# Altium schematic sheet future_connector.SchDoc
size A4
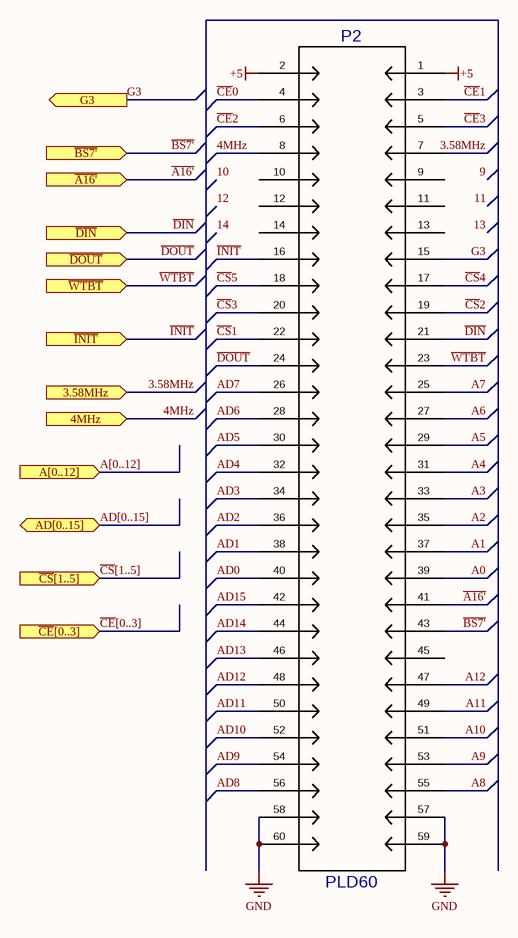
[diagram p0: future_connector.SchDoc]

## Parts
P2  PLD60  [PLD60]

## Ports
3.58MHz (in), 4MHz (in), A[0..12] (in), AD[0..15] (bidir), G3 (out), ~{A16'} (in), ~{BS7'} (in), ~{CE}[0..3] (in), ~{CS}[1..5] (in), ~{DIN} (in), ~{DOUT} (in), ~{INIT} (in), ~{WTBT} (in)

## Nets
+5: P2.1 P2.2
GND: P2.57 P2.58 P2.59 P2.60
3.58MHz: P2.7 ; port 3.58MHz
4MHz: P2.8 ; port 4MHz
A0: P2.39
A1: P2.37
A2: P2.35
A3: P2.33
A4: P2.31
A5: P2.29
A6: P2.27
A7: P2.25
A8: P2.55
A9: P2.53
A10: P2.51
A11: P2.49
A12: P2.47
~{A16'}: P2.41 ; port ~{A16'}
AD0: P2.40
AD1: P2.38
AD2: P2.36
AD3: P2.34
AD4: P2.32
AD5: P2.30
AD6: P2.28
AD7: P2.26
AD8: P2.56
AD9: P2.54
AD10: P2.52
AD11: P2.50
AD12: P2.48
AD13: P2.46
AD14: P2.44
AD15: P2.42
~{BS7'}: P2.43 ; port ~{BS7'}
~{CE}0: P2.4
~{CE}1: P2.3
~{CE}2: P2.6
~{CE}3: P2.5
~{CS}1: P2.22
~{CS}2: P2.19
~{CS}3: P2.20
~{CS}4: P2.17
~{CS}5: P2.18
~{DIN}: P2.21 ; port ~{DIN}
~{DOUT}: P2.24 ; port ~{DOUT}
G3: P2.15 ; port G3
~{INIT}: P2.16 ; port ~{INIT}
~{WTBT}: P2.23 ; port ~{WTBT}

Not connected (* = marked no-connect by the designer): P2 9 10 11 12 13 14 45

## Buses and harness runs
bus A[0..12] = port A[0..12]
bus AD[0..15] = port AD[0..15]
bus ~{CE}[0..3] = port ~{CE}[0..3]
bus ~{CS}[1..5] = port ~{CS}[1..5]

## Notes on the sheet
- Labels drawn without touching a wire or pin: 9, 10, 11, 12, 13, 14

## Library data of the parts
P2 = PLD60: Value: *